# Altium schematic sheet Motor driver sheet.SchDoc
size A4
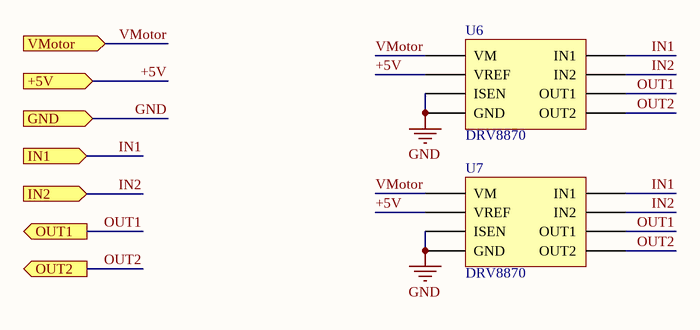
[diagram p0: Motor driver sheet.SchDoc]

## Parts
U6  DRV8870  [8-Pin HSOP]
U7  DRV8870  [8-Pin HSOP]

## Ports
+5V (in), GND (in), IN1 (in), IN2 (in), OUT1 (out), OUT2 (out), VMotor (in)

## Nets
GND: U6.1(GND) U6.7(ISEN) U7.1(GND) U7.7(ISEN) ; port GND
+5V: U6.4(VREF) U7.4(VREF) ; port +5V
IN1: U6.2(IN1) U7.2(IN1) ; port IN1
IN2: U6.3(IN2) U7.3(IN2) ; port IN2
OUT1: U6.6(OUT1) U7.6(OUT1) ; port OUT1
OUT2: U6.8(OUT2) U7.8(OUT2) ; port OUT2
VMotor: U6.5(VM) U7.5(VM) ; port VMotor